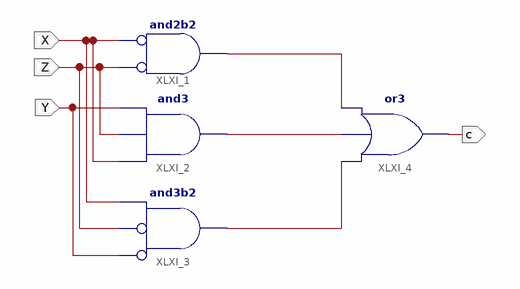
[diagram p0: schematic sheet 1]
// Xilinx ISE schematic circuitoC.sch (spartan3e) as structural Verilog: 4 symbols, 4 ports
module circuitoC (
  input  X,
  input  Z,
  input  Y,
  output c
);

  wire XLXN_1, XLXN_2, XLXN_3;

  and XLXI_1 (XLXN_1, ~Z, ~X);  // and2b2
  and XLXI_2 (XLXN_2, X, Z, Y);
  and XLXI_3 (XLXN_3, ~Y, ~Z, X);  // and3b2
  or XLXI_4 (c, XLXN_3, XLXN_2, XLXN_1);
endmodule
